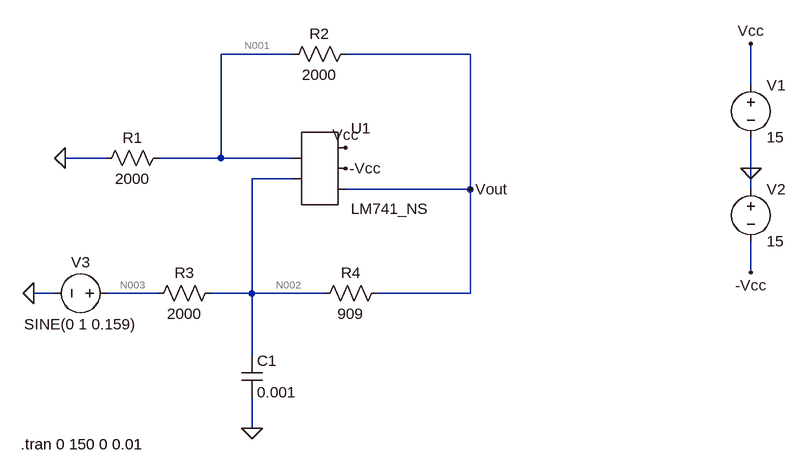
[diagram p0: schematic es17btech11009.asc]
* es17btech11009.asc
* U1: LM741_NS (symbol AutoGenerated\LM741_NS not available, pins judged from their places): pin1=N001 pin2=N002 pin3=Vcc pin4=-Vcc pin5=Vout
R1 N001 0 2000
R2 Vout N001 2000
R3 N002 N003 2000
R4 Vout N002 909
C1 N002 0 0.001
V1 Vcc 0 15
V2 0 -Vcc 15
V3 N003 0 SINE(0 1 0.159)
.tran 0 150 0 0.01
.backanno
.end

* Results of the author's LTspice run, read from the files saved beside the schematic
* Operating Point, zero values left out:
*   V(n002) = 3.624 mV
*   V(n001) = 2.624 mV
*   V(-vcc) = -15 V
*   V(vcc) = 15 V
*   V(vout) = 5.364 mV
*   I(R4) = 1.914 µA
*   I(R3) = 1.812 µA
*   I(R2) = 1.37 µA
*   I(R1) = 1.312 µA
*   I(V3) = 1.812 µA
*   I(V2) = -1.7 mA
*   I(V1) = -1.703 mA
*   Ix(u1:1) = 57.86 nA
*   Ix(u1:2) = 101.9 nA
*   Ix(u1:99) = 1.703 mA
*   Ix(u1:50) = -1.7 mA
*   Ix(u1:28) = -3.284 µA
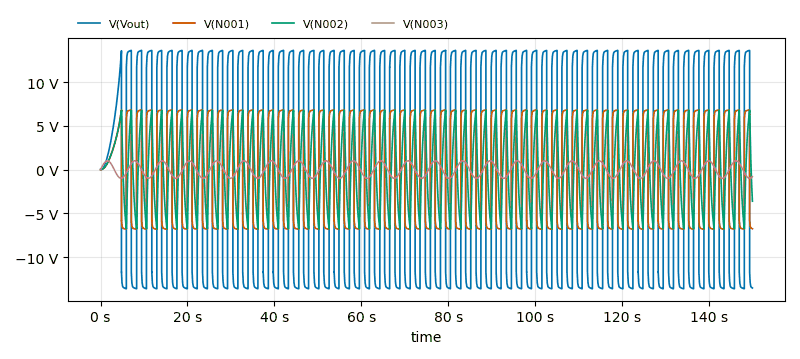
[diagram p1: Transient Analysis of es17btech11009.asc, plotted from the saved traces]
* Transient Analysis, 1 run:
*   V(Vout): min -13.63 V, max 13.63 V, average 86.72 mV, rms 13.19 V, last -13.54 V
*   V(N001): min -6.814 V, max 6.813 V, average 43.37 mV, rms 6.586 V, last -6.762 V
*   V(N002): min -6.795 V, max 6.802 V, average 75.41 mV, rms 4.29 V, last -3.616 V
*   V(N003): min -1 V, max 1 V, average 2.668 mV, rms 708.1 mV, last -809 mV